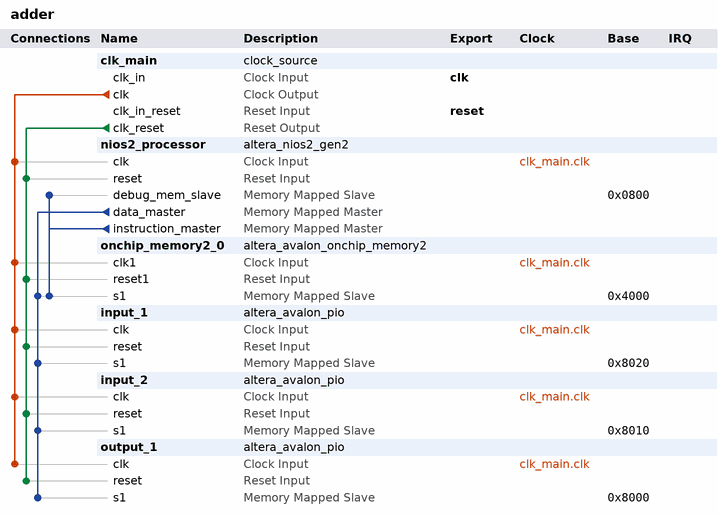
[diagram p0: system contents]
# Platform Designer (Qsys) system adder, Cyclone V 5CSEBA6U23I7
# Parameters at their usual value, and those the tool derives, are not listed.
package require -exact qsys 23.1
create_system adder
set_project_property DEVICE_FAMILY {Cyclone V}
set_project_property DEVICE 5CSEBA6U23I7

add_instance clk_main clock_source 23.1
set_instance_parameter_value clk_main clockFrequency 50000000

add_instance nios2_processor altera_nios2_gen2 23.1
set_instance_parameter_value nios2_processor dcache_size 2048
set_instance_parameter_value nios2_processor exceptionSlave onchip_memory2_0.s1
set_instance_parameter_value nios2_processor icache_size 4096
set_instance_parameter_value nios2_processor impl Fast
set_instance_parameter_value nios2_processor resetSlave onchip_memory2_0.s1

add_instance onchip_memory2_0 altera_avalon_onchip_memory2 23.1
set_instance_parameter_value onchip_memory2_0 dataWidth 32
set_instance_parameter_value onchip_memory2_0 dualPort false
set_instance_parameter_value onchip_memory2_0 initMemContent true
set_instance_parameter_value onchip_memory2_0 initializationFileName onchip_mem.hex
set_instance_parameter_value onchip_memory2_0 memorySize 16372

add_instance input_1 altera_avalon_pio 23.1
set_instance_parameter_value input_1 direction Input
set_instance_parameter_value input_1 width 2

add_instance input_2 altera_avalon_pio 23.1
set_instance_parameter_value input_2 direction Input
set_instance_parameter_value input_2 width 2

add_instance output_1 altera_avalon_pio 23.1
set_instance_parameter_value output_1 direction Output
set_instance_parameter_value output_1 width 3

# connections
add_connection clk_main.clk input_1.clk clock
add_connection clk_main.clk input_2.clk clock
add_connection clk_main.clk nios2_processor.clk clock
add_connection clk_main.clk onchip_memory2_0.clk1 clock
add_connection clk_main.clk output_1.clk clock
add_connection clk_main.clk_reset input_1.reset reset
add_connection clk_main.clk_reset input_2.reset reset
add_connection clk_main.clk_reset nios2_processor.reset reset
add_connection clk_main.clk_reset onchip_memory2_0.reset1 reset
add_connection clk_main.clk_reset output_1.reset reset
add_connection nios2_processor.data_master input_1.s1 avalon
set_connection_parameter_value nios2_processor.data_master/input_1.s1 baseAddress 0x8020
add_connection nios2_processor.data_master input_2.s1 avalon
set_connection_parameter_value nios2_processor.data_master/input_2.s1 baseAddress 0x8010
add_connection nios2_processor.data_master onchip_memory2_0.s1 avalon
set_connection_parameter_value nios2_processor.data_master/onchip_memory2_0.s1 baseAddress 0x4000
add_connection nios2_processor.data_master output_1.s1 avalon
set_connection_parameter_value nios2_processor.data_master/output_1.s1 baseAddress 0x8000
add_connection nios2_processor.instruction_master nios2_processor.debug_mem_slave avalon
set_connection_parameter_value nios2_processor.instruction_master/nios2_processor.debug_mem_slave baseAddress 0x0800
add_connection nios2_processor.instruction_master onchip_memory2_0.s1 avalon
set_connection_parameter_value nios2_processor.instruction_master/onchip_memory2_0.s1 baseAddress 0x4000

# exported interfaces
add_interface clk clock sink
set_interface_property clk EXPORT_OF clk_main.clk_in
add_interface reset reset sink
set_interface_property reset EXPORT_OF clk_main.clk_in_reset

set_interconnect_requirement {$system} qsys_mm.clockCrossingAdapter HANDSHAKE
set_interconnect_requirement {$system} qsys_mm.enableEccProtection FALSE
set_interconnect_requirement {$system} qsys_mm.insertDefaultSlave FALSE
set_interconnect_requirement {$system} qsys_mm.maxAdditionalLatency 1

save_system adder.qsys
